# EAGLE design RS485-CANBUS-WeMos (EAGLE 9.6.2)
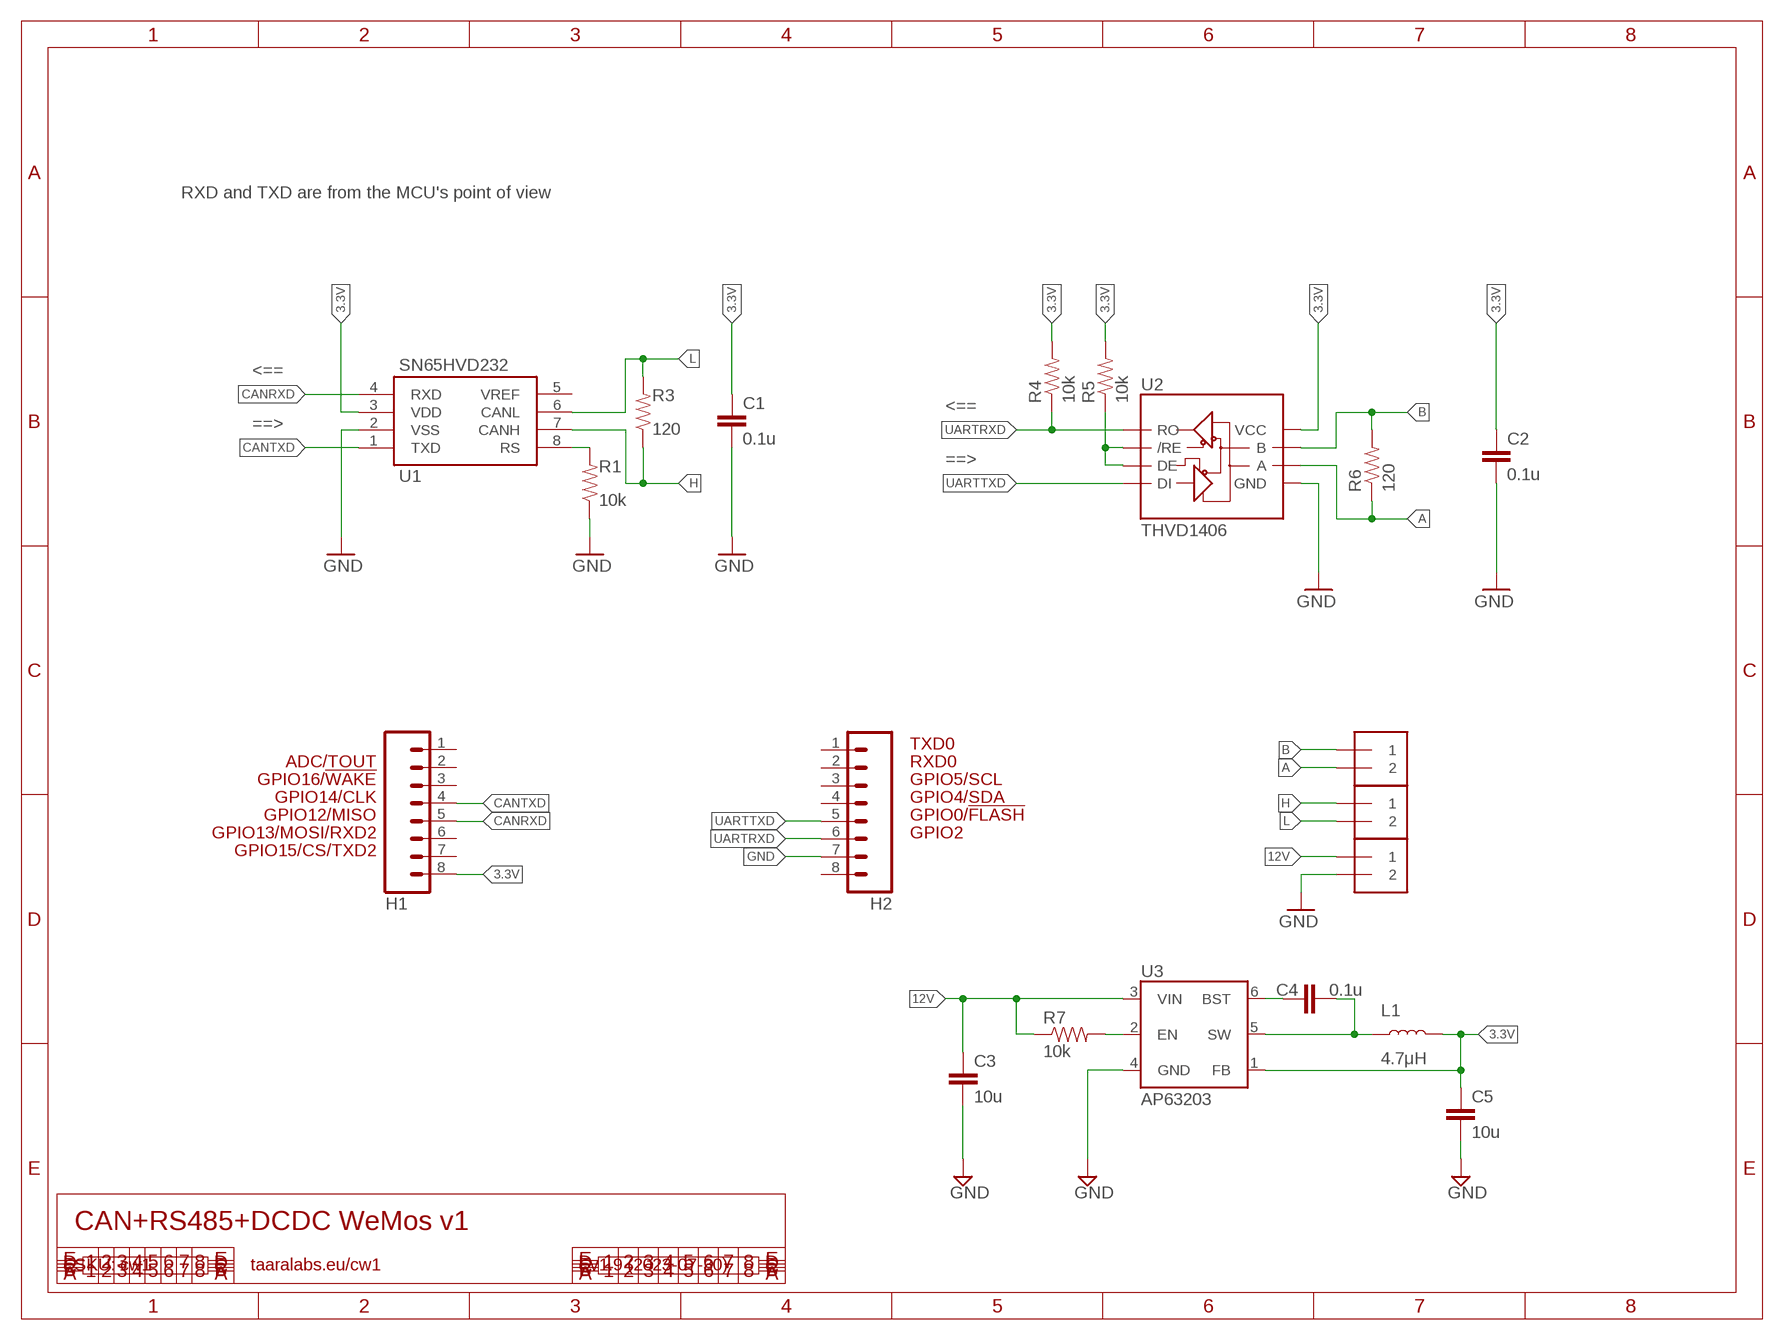
[diagram p0: schematic, sheet 1]

## Parts
C1  0.1u  CAP0805  [0805]
C2  0.1u  CAP0805  [0805]
C3  10u  CAP1210  [1210]
C4  0.1u  CAP0805  [0805]
C5  10u  CAP0805  [0805]
H1  M08  [1X08]
H2  M08  [1X08]
J1  1X2-3.5MM  [1X2-3.5MM]
J2  1X2-3.5MM  [1X2-3.5MM]
J3  1X2-3.5MM  [1X2-3.5MM]
L1  4.7μH  4.7μH_SHIELDED_INDUCTORNPIS_LS  [INDUCTOR_4X4MM]
R1  10k  RESISTOR0805-RES  [0805]
R3  120  RESISTOR0805-RES  [0805]
R4  10k  RESISTOR0805-RES  [0805]
R5  10k  RESISTOR0805-RES  [0805]
R6  120  RESISTOR0805-RES  [0805]
R7  10k  RESISTOR0805-RES  [0805]
U1  SN65HVD232  MCP2551  [SO08]
U2  THVD1406  RS485SOIC  [SO08]
U3  AP63203  [SOT23-6]

## Nets
3.3V: C1.1 C2.1 C5.1 H1.8 L1.P$2 R4.2 R5.2 U1.3(VDD) U2.8(VCC) U3.1(FB)
12V: C3.1 J2.1 R7.1 U3.3(VIN)
/SHDN: R5.1 U2.2(/RE) U2.3(DE)
A: J3.2 R6.1 U2.6(A)
B: J3.1 R6.2 U2.7(B)
BST: C4.1 U3.6(BST)
CANRXD: H1.5 U1.4(RXD)
CANTXD: H1.4 U1.1(TXD)
EN: R7.2 U3.2(EN)
GND: C1.2 C2.2 C3.2 C5.2 H2.7 J2.2 R1.1 U1.2(VSS) U2.5(GND) U3.4(GND)
H: J1.1 R3.1 U1.7(CANH)
L: J1.2 R3.2 U1.6(CANL)
RS: R1.2 U1.8(RS)
SW: C4.2 L1.P$1 U3.5(SW)
UARTRXD: H2.6 R4.1 U2.1(RO)
UARTTXD: H2.5 U2.4(DI)
Unconnected: H1.1 H1.2 H1.3 H1.6 H1.7 H2.1 H2.2 H2.3 H2.4 H2.8 U1.5(VREF)

## Notes on the sheet
- RXD and TXD are from the MCU's point of view
- <==
- <==
- ==>
- ==>
- TXD0
- ADC/TOUT | RXD0
- GPIO16/!WAKE | GPIO5/SCL
- GPIO14/CLK | GPIO4/SDA
- GPIO12/MISO | GPIO0/!FLASH
- GPIO13/MOSI/RXD2 | GPIO2
- GPIO15/CS/TXD2
- CAN+RS485+DCDC WeMos v1
- SKU: cw1 | taaralabs.eu/cw1 | v1.9 (2023-07-30)

## Library data of the parts
C1-C5 = SparkFun:CAP: Capacitor Standard 0603 ceramic capacitor, and 0.1" leaded capacitor.
H1 H2 = freetronics-original:M08: Header 8 Standard 8-pin 0.1" header. Use with straight break away headers (SKU : PRT-00116), right angle break away headers (PRT-00553), swiss pins (PRT-00743), machine pins (PRT-00117), and female headers (PRT-00115).
J1-J3 = adafruit:1X2: 3.5mm Terminal block http://www.ladyada.net/library/pcb/eaglelibrary.html
L1 = SparkFun-Coils:4.7μH_SHIELDED_INDUCTOR: 4.7uH Inductor 4.7uH 1.4A 50mOhm 1008(2520) Package Shielded; PROD_ID: NDUC-15245
R1 R3-R7 = SparkFun:RESISTOR: Resistor Basic schematic elements and footprints for 0603, 1206, and PTH resistors.
U1 = SparkFun-DigitalIC:MCP2551: CAN transceiver; PROD_ID: IC-09907
U2 = SparkFun:RS485
U3 = SparkFun-IC-Power:AP63203: Diodes Inc. AP63203 3.8V-32V input 3.3V Buck The AP63200/AP63201/AP63203/AP63205 is a 2A, synchronous buck converter with a wide input voltage range of 3.8V to 32V and fully integrates a 125mΩ high-side power MOSFET and a 68mΩ lowside power MOSFET to provide high-efficiency step-down DC/DC conversion; PROD_ID: VREG-15244

## Net classes
0 default: width 0.203 mm, drill 0.356 mm, clearance 0.152 mm
1 power: width 0.203 mm, clearance 0.152 mm

## Board
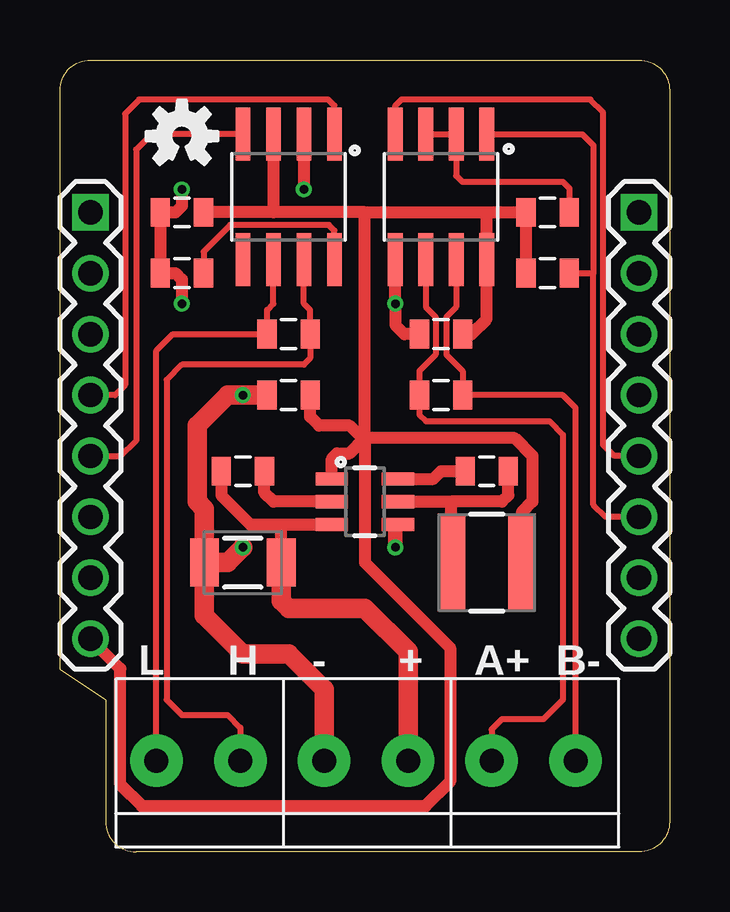
[diagram p1: board, top side]
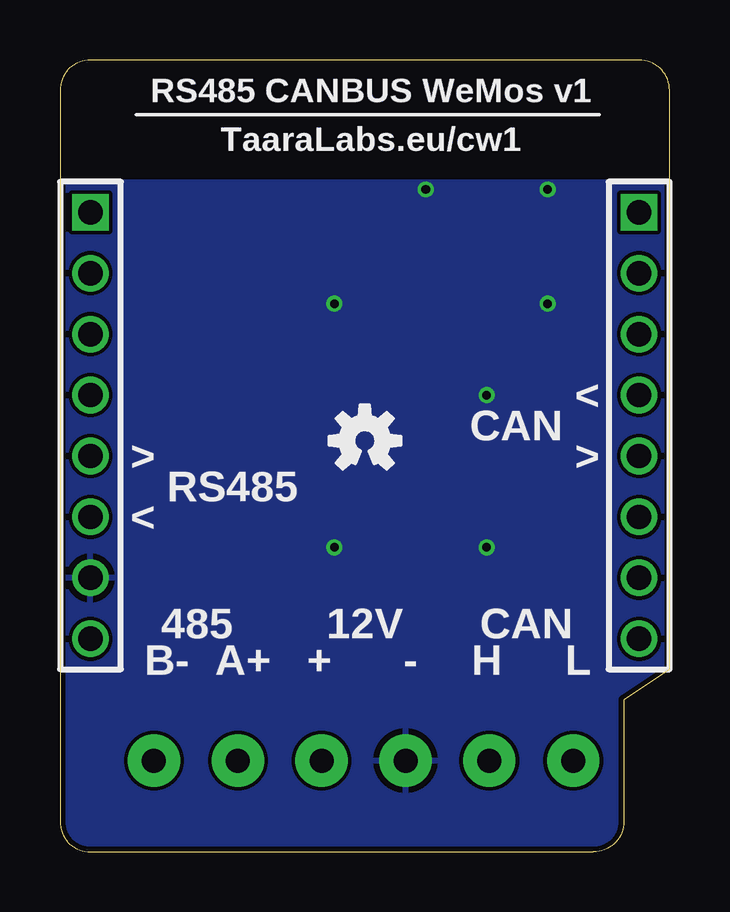
[diagram p2: board, bottom side, seen from below]

Size 25.4 x 33.02 mm. Coordinates in mm from the lower left corner, seen from the top.
Outline: 25.4,31.75 25.4,1.27 arc-90 24.13,0 3.17,0 arc-90 1.91,1.27 1.91,6.35 0,7.62 0,31.75 arc-90 1.27,33.02 24.13,33.02 arc-90 25.4,31.75
Copper layers (1*16): Top 0.035mm / dielectric 1.5mm / Bottom 0.035mm
Design rules "ElectroDragon_2layer_DRU_no_angle_20140221": minimum track width 6mil, minimum drill 12mil, track to track 6mil, track to pad 6mil, pad to pad 6mil, via to via 6mil, smd to smd 6mil, copper to edge 8mil, drill to drill 6mil, minimum pad ring 10mil, minimum via ring 6mil, stop-mask expansion 4mil, vias tented up to drill 100mil, thermal gap 10mil

### Footprints (pad centres in the part's own frame; a part is rotated, then mirrored left to right if it is on the bottom)
0805 = smd 0.8 x 1.2: 1 -0.9,0; 2 0.9,0
1210 = smd 1.2 x 2: 1 -1.6,0; 2 1.6,0
1X08 = drill 1.016 square: 1 0,0 | drill 1.016: 2 2.54,0; 3 5.08,0; 4 7.62,0; 5 10.16,0; 6 12.7,0; 7 15.24,0; 8 17.78,0
1X2-3.5MM = drill 1 pad 2.184: 1 1.8,0; 2 -1.7,0
INDUCTOR_4X4MM = smd 4.089 x 1.143: P$1 0,1.473; P$2 0,-1.473
SO08 = smd 0.61 x 2.21: 1 -1.905,-2.616; 2 -0.635,-2.616; 3 0.635,-2.616; 4 1.905,-2.616; 5 1.905,2.616; 6 0.635,2.616; 7 -0.635,2.616; 8 -1.905,2.616
SOT23-6 = smd 0.55 x 1.35: 1 -0.95,-1.375; 2 0,-1.375; 3 0.95,-1.375; 4 0.95,1.375; 5 0,1.375; 6 -0.95,1.375

### Placement (x,y rotation side)
C1  5.08,26.67 180 top
C2  15.88,21.59 180 top
C3  7.62,12.06 180 top
C4  17.78,15.88 0 top
C5  9.53,19.05 180 top
H1  1.27,26.67 270 top
H2  24.13,26.67 270 top
J1  5.71,3.81 0 top
J2  12.7,3.81 0 top
J3  19.68,3.81 0 top
L1  17.78,12.06 90 top
R1  5.08,24.13 0 top
R3  9.53,21.59 180 top
R4  20.32,24.13 180 top
R5  20.32,26.67 180 top
R6  15.88,19.05 0 top
R7  7.62,15.88 0 top
U1  9.53,27.3 180 top
U2  15.88,27.3 180 top
U3  12.7,14.61 270 top
U$1  [OSHW-LOGO-S]  5.08,29.84 0 top
U$2  [OSHW-LOGO-S]  12.7,17.14 0 bottom

### Tracks (layer width: path | path; a pad name or v marks a point on that pad's centre or on a via)
3.3V
  Top 0.508: C2.1 17.14,21.59 17.78,22.23 U2.8 17.78,26.67 | L1.P$2 19.25,14.17 19.68,14.61 19.68,16.51 18.95,17.25 12.7,17.25 | 12.7,26.67 8.89,26.67 | 8.89,26.67 C1.1 | 12.7,17.25 12.7,26.67 | U1.3 8.89,26.67 | R4.2 R5.2 17.78,26.67 | 12.7,17.25 12.7,12.06 16.25,8.51 16.25,2.94 15.22,1.91 3.42,1.91 2.52,2.81 2.52,7.64 H1.8 | 12.7,17.25 12.6,17.25 12.06,17.78 10.79,17.78 10.43,18.15 C5.1 | 12.7,26.67 17.78,26.67 | 12.7,17.25 12.06,16.61 11.54,16.61 11.32,16.41 U3.1
12V
  Top 0.508: R7.1 6.72,14.87 7.93,13.65 9.22,13.65 | 9.22,13.65 U3.3 | C3.1 9.22,13.65
  Top 0.813: C3.1 9.22,10.46 9.53,10.16 12.7,10.16 14.5,8.36 J2.1
/SHDN
  Top 0.254: U2.3 U2.2 16.51,28.19 16.76,27.94 20.95,27.94 21.22,27.68 R5.1
A
  Top 0.254: U2.6 15.24,22.72 15.65,22.31 15.65,20.73 14.97,20.05 R6.1 14.97,18.22 15.24,17.96 20.4,17.96 20.95,17.4 20.95,6.35 20.14,5.54 18.41,5.54 17.98,5.11 J3.2
B
  Top 0.254: U2.7 16.51,22.72 16.1,22.31 16.1,20.73 16.77,20.05 R6.2 20.95,19.05 21.48,18.52 J3.1
BST
  Top 0.508: U3.6 15.55,15.55 15.88,15.88 C4.1
CANRXD
  Top 0.254: H1.5 2.54,16.51 3.17,17.14 3.17,29.28 3.81,29.92 U1.4
CANTXD
  Top 0.254: U1.1 11.43,31.11 11.18,31.37 3.3,31.37 2.71,30.78 2.71,19.48 2.29,19.05 H1.4
EN
  Top 0.508: R7.2 8.52,14.97 8.89,14.61 U3.2
GND  (via drill 0.36)
  Top 0.406: 13.97,13.55 U3.4
  Top 0.508: U2.5 v13.97,22.86 13.97,21.97 14.35,21.59 C2.2 | v5.08,27.62 5.08,26.93 4.82,26.67 C1.2 R1.1 4.82,24.13 5.08,23.86 v5.08,22.86 | U1.2 v10.16,27.62
  Top 0.61: v13.97,12.7 13.97,13.55
  Top 0.813: v7.62,12.7 6.99,12.06 C3.2 | C5.2 v7.62,19.05 6.99,19.05 5.71,17.78 5.71,14.61 6.02,14.3 C3.2 | C3.2 6.02,9.86 7.62,8.26 9.53,8.26 11,6.78 J2.2
  pour Bottom: 0,0 25.4,0 25.4,27.94 0,27.94
H
  Top 0.254: U1.7 10.16,22.86 10.43,22.59 R3.1 10.43,20.59 10.16,20.32 5.08,20.32 4.45,19.68 4.45,6.35 5.08,5.71 6.99,5.71 7.51,5.18 J1.1
L
  Top 0.254: U1.6 8.89,22.86 8.62,22.59 R3.2 4.7,21.59 4.01,20.91 J1.2
RS
  Top 0.254: U1.8 11.43,25.91 11.2,26.14 7.09,26.14 5.98,25.03 R1.2
SW
  Top 0.508: C4.2 18.68,14.87 18.41,14.61 16.31,14.61 | U3.5 16.31,14.61 | L1.P$1 16.31,14.61
UARTRXD
  Top 0.254: R4.1 22.23,24.13 | U2.1 21.77,29.92 22.23,29.46 22.23,24.13 | H2.6 22.73,13.97 22.23,14.48 22.23,24.13
UARTTXD
  Top 0.254: U2.4 13.97,31.11 14.22,31.37 22.1,31.37 22.63,30.84 22.63,16.97 23.09,16.51 H2.5

### Text on the board
tPlace: L | H | - | + | A+ | B-
bPlace: RS485 CANBUS WeMos v1 | TaaraLabs.eu/cw1 | < | CAN | > | > | RS485 | < | CAN | 12V | 485 | L | H | - | + | A+ | B-